# Altium schematic sheet Sheet_X_battery.SchDoc
size A4
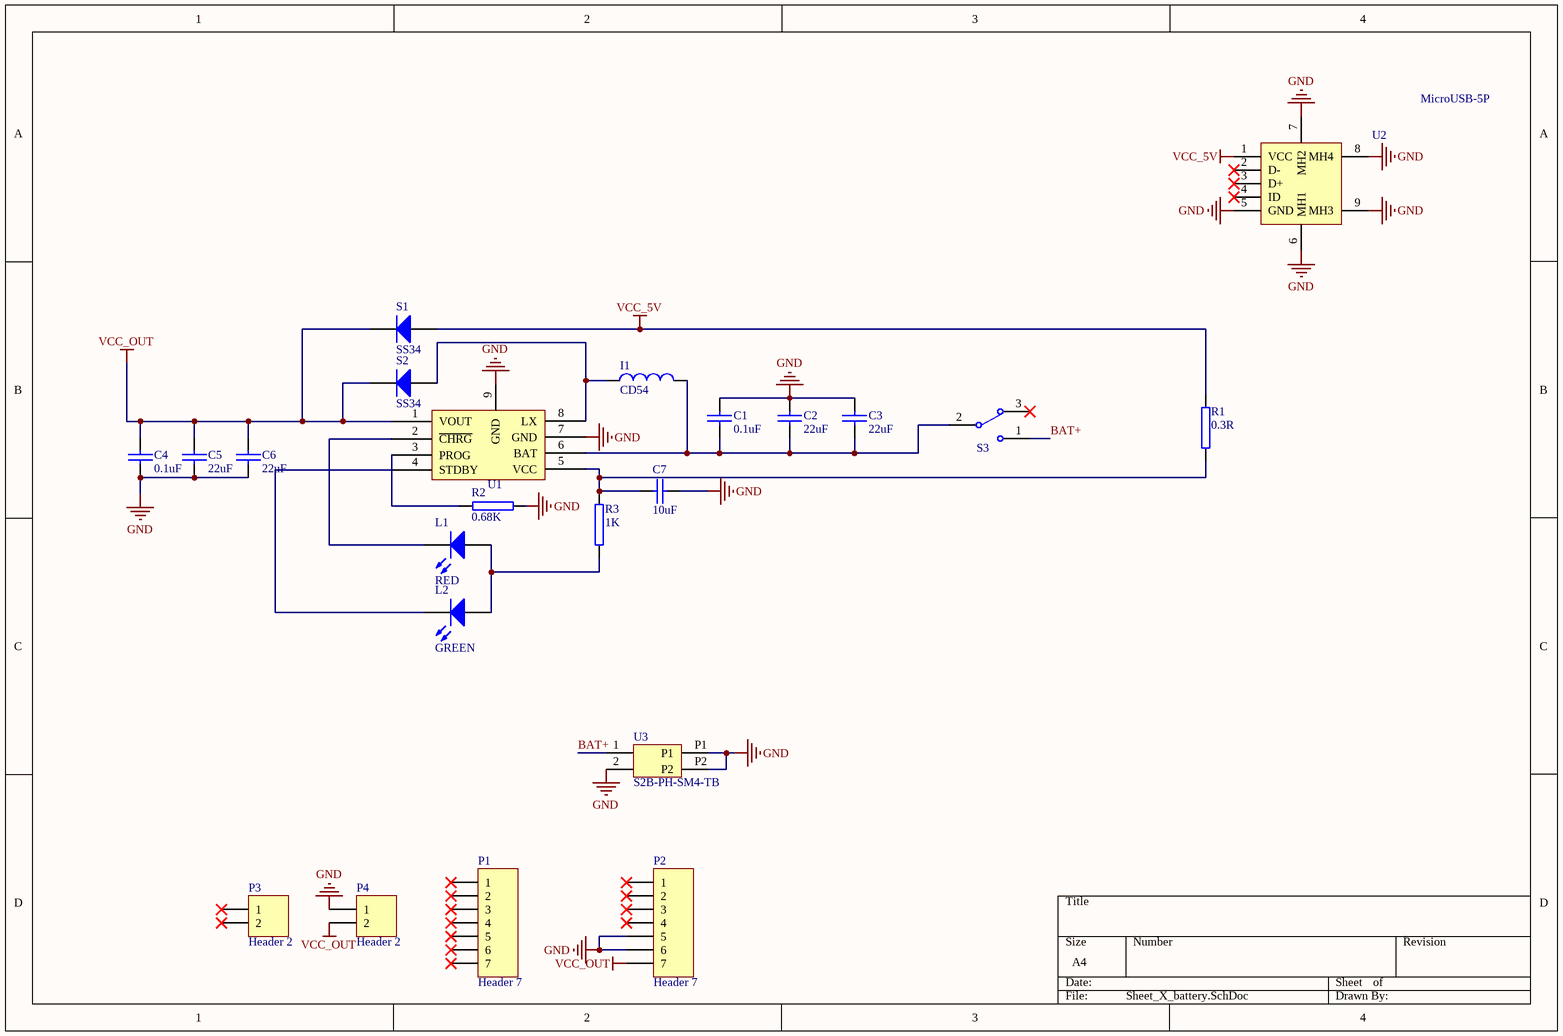
[diagram p0: Sheet_X_battery.SchDoc]

## Parts
C1  0.1uF  [C0603]
C2  22uF  [C0603]
C3  22uF  [C0603]
C4  0.1uF  [C0603]
C5  22uF  [C0603]
C6  22uF  [C0603]
C7  10uF  [C0603]
I1  CD54  [introductor_cd54]
L1  RED  [LED]
L2  GREEN  [LED]
P1  Header 7  [HDR1X7]
P2  Header 7  [HDR1X7]
P3  Header 2  [HDR1X2]
P4  Header 2  [HDR1X2]
R1  0.3R  [R0603]
R2  0.68K  [R0603]
R3  1K  [R0603]
S1  SS34  [Diode]
S2  SS34  [Diode]
S3  Switch for shield  [Switch_battery]  (value not drawn)
U1  5V 1A  [TP5410]  (value not drawn)
U2  MicroUSB-5P  [MICROUSB_5S]
U3  S2B-PH-SM4-TB  [S2B-PH-SM4-TB]

## Nets
GND: C1.1 C2.1 C3.1 C4.2 C5.2 C6.2 C7.2 P2.5 P2.6 P4.1 R2.2 U1.7(GND) U1.9(GND) U2.5(GND) U2.6(MH1) U2.7(MH2) U2.8(MH4) U2.9(MH3) U3.2 U3.P1 U3.P2
VCC_5V: R1.2 S1.1(A) U2.1(VCC)
VCC_OUT: C4.1 C5.1 C6.1 P2.7 P4.2 S1.2(K) S2.2(K) U1.1(VOUT)
BAT+: S3.1 U3.1
NetC1_2: C1.2 C2.2 C3.2 I1.2 S3.2 U1.6(BAT)
NetC7_1: C7.1 R1.1 R3.2 U1.5(VCC)
NetI1_1: I1.1 S2.1(A) U1.8(LX)
NetL1_1: L1.1(K) U1.2(~{CHRG})
NetL1_2: L1.2(A) L2.2(A) R3.1
NetL2_1: L2.1(K) R2.1 U1.3(PROG) U1.4(STDBY)

Not connected (* = marked no-connect by the designer): P1 1* 2* 3* 4* 5* 6* 7*; P2 1* 2* 3* 4*; P3 1* 2*; S3 3*; U2 2(D-)* 3(D+)* 4(ID)*

## Library data of the parts
C1-C7 = C0603: 贴片电容
I1 = Inductor_CD54: 大功率电感
L1 L2 = LED: 0603 led
P1 P2 = Header 7: Header, 7-Pin; LatestRevisionDate: 17-Jul-2002; LatestRevisionNote: Re-released for DXP Platform.; Publisher: Altium Limited
P3 P4 = Header 2: Header, 2-Pin; LatestRevisionDate: 17-Jul-2002; LatestRevisionNote: Re-released for DXP Platform.; Publisher: Altium Limited
R1-R3 = R0603: 贴片电阻
  R1: Value: 0.3R
S1 = Diode: 大电流二极管; Value: SS24
S2 = Diode: 大电流二极管
S3 = Switch_battery: 三脚开关
U1 = TP5410: 电源芯片
U2 = MicroUSB_5S: Micro USB插脚
U3 = S2B-PH-SM4-TB: 贴片2.0mm底座